# EasyEDA Pro project MSDRv2.eprj, board 4xAGCV1
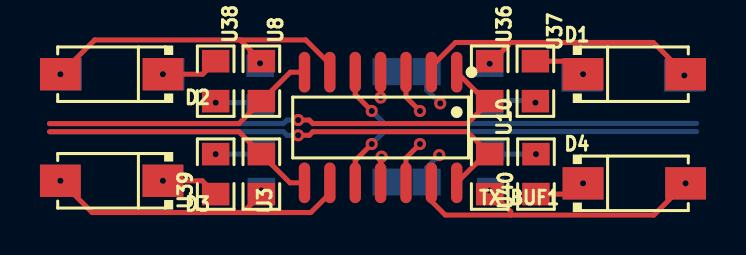
[diagram p11: board, top side]
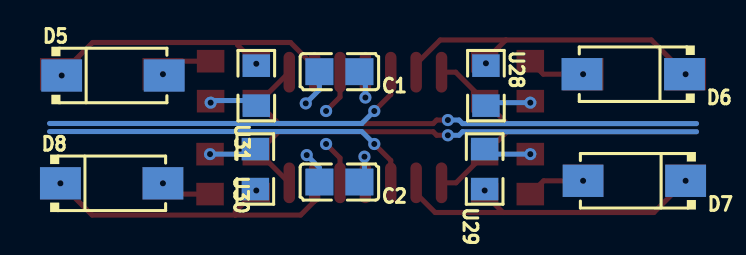
[diagram p12: board, bottom side, seen from below]

No outline. copper layers: Top Layer, Inner1, Inner2, Bottom Layer. Coordinates in mm from the lowest, leftmost part position.
Stack: Top Layer 0.035mm Outer layer thickness 1oz / Dielectric1 0.2104mm 7628 RC49% 8.6mil / Inner1 0.0152mm Inner layer thickness / Dielectric2 1.065mm 1.1mm H/HOZ Copper / Inner2 0.0152mm Inner layer thickness / Dielectric3 0.2104mm 7628 RC49% 8.6mil / Bottom Layer 0.035mm Outer layer thickness 1oz

## Design rules (mm)
net OUT2: DP2
net OUT3: DP1
net IN2: DP4
net IN3: DP3
net OUT1: DP2
net IN1: DP4
net IN4: DP3
net OUT4: DP1
template: JLCPCB Capability(Two Layers Board)
spacing copperThickness1oz (default): track to track 0.102, other pairs 0.152 to 0.3
spacing copperThickness2oz: track to track 0.203, other pairs 0.152 to 0.3
track width copperThickness1oz (default): min 0.127, default 0.254, max 2.54
track width copperThickness2oz: min 0.203, default 0.254, max 2.54
differential pair differentialPair (default): width min 0.127, default 0.254, max 2.54; gap min 0.152, default 0.152
via viaSize (default): diameter min 0.5, default 0.61, max 10; hole min 0.3, default 0.305, max 6.3

## Placement (name value [footprint] x y rotation side)
C1  100nF  [C0805]  14.76 5.59 0 bottom
C2  100nF  [C0805]  14.76 0.06 0 bottom
D1  -  [SMA_L4.4-W2.8-LS5.4-RD]  26.16 5.46 0 top
D2  -  [SMA_L4.4-W2.8-LS5.4-RD]  0 5.46 180 top
D3  -  [SMA_L4.4-W2.8-LS5.4-RD]  0 0.13 180 top
D4  -  [SMA_L4.4-W2.8-LS5.4-RD]  26.16 0 0 top
D5  -  [SMA_L4.4-W2.8-LS5.4-RD]  26.1 5.4 180 bottom
D6  -  [SMA_L4.4-W2.8-LS5.4-RD]  0.06 5.46 0 bottom
D7  -  [SMA_L4.4-W2.8-LS5.4-RD]  0 0.13 0 bottom
D8  -  [SMA_L4.4-W2.8-LS5.4-RD]  26.16 0 180 bottom
TX_BUF1  CLC4601ISO14X  [SOIC-14_L8.7-W3.9-P1.27-LS6.0-BL]  13.46 2.79 180 top
U3  1120  [R0805]  7.49 0.46 270 top
U8  1120  [R0805]  7.49 5.11 270 top
U10  1120  [R0805]  18.92 0.46 270 top
U28  1120  [R0805]  7.43 4.89 270 bottom
U29  1120  [R0805]  7.49 0.71 90 bottom
U30  1120  [R0805]  18.97 0.71 90 bottom
U31  1120  [R0805]  18.92 4.89 90 bottom
U36  1120  [R0805]  18.92 5.11 270 top
U37  1120  [R0805]  21.21 5.11 270 top
U38  1120  [R0805]  5.21 5.11 270 top
U39  1120  [R0805]  5.21 0.46 90 top
U40  1120  [R0805]  21.24 0.46 90 top

## Footprints (pads in the part's own frame, mm; a bottom-side part is the same pattern mirrored in y, then rotated)
C0805
  rect 1.41x1.35 smd: 1(-1,0) 2(1,0)
R0805
  rect 1.133x1.377 smd: 1(-1,0) 2(1,0)
SMA_L4.4-W2.8-LS5.4-RD
  rect 2.046x1.62 smd: 1(-2.566,0) 2(2.566,0)
SOIC-14_L8.7-W3.9-P1.27-LS6.0-BL
  oval 0.574x2.038 smd: 1(-3.81,-2.769) 2(-2.54,-2.769) 3(-1.27,-2.769) 4(0,-2.769) 5(1.27,-2.769) 6(2.54,-2.769) 7(3.81,-2.769) 8(3.81,2.769) 9(2.54,2.769) 10(1.27,2.769) 11(0,2.769) 12(-1.27,2.769) 13(-2.54,2.769) 14(-3.81,2.769)

## Nets
As in the schematic.

## Via types
v1: diameter 0.61, hole 0.305, Top Layer to Bottom Layer, 26 vias

## Routing (per net, layer and track width the routed paths; a pad name or vN(x,y) marks a point on that pad's centre or on a via; arc(x,y) is an arc through that point)
+5V: length 2.7
  Top Layer w0.254: TX_BUF1.4 v1(13.46,4.29)
  Bottom Layer w0.254: C1.1 13.46,5.29 v1(13.46,4.29)
-5V: length 2.7
  Top Layer w0.254: v1(13.51,1.33) 13.46,1.29 TX_BUF1.11
  Bottom Layer w0.254: C2.1 13.51,0.32 v1(13.51,1.33)
GND: length 12.6
  Bottom Layer w0.254: C1.2 15.76,4.68 v1(16.45,4) ; v1(21.21,4.04) 21.1,4.14 18.92,4.14 ; C2.2 15.76,0.78 v1(16.4,1.41) ; 18.97,1.46 v1(21.24,1.46) ; 7.49,1.46 v1(5.21,1.46) ; v1(5.21,4.04) 7.32,4.04 7.43,4.14
IN1: length 16.3
  Top Layer w0.254: v1(15.43,1.97) 14.73,1.27 TX_BUF1.12
  Inner1 w0.254: v1(15.43,1.97) 16.05,2.59 29.27,2.59
IN2: length 16.3
  Top Layer w0.254: TX_BUF1.3 14.73,4.32 v1(15.43,3.62)
  Inner1 w0.254: v1(15.43,3.62) 16.05,3 29.27,3
IN3: length 18.8
  Top Layer w0.254: v1(13.02,3.62) 12.19,4.44 TX_BUF1.5
  Bottom Layer w0.254: v1(13.02,3.62) 13.64,3 29.27,3
IN4: length 18.8
  Top Layer w0.254: v1(13.02,1.97) 12.19,1.14 TX_BUF1.10
  Bottom Layer w0.254: v1(13.02,1.97) 13.64,2.59 29.27,2.59
OUT1: length 24.9
  Top Layer w0.254: TX_BUF1.14 18.71,1.46 U10.1 17.8,2.58 10.07,2.58 9.89,2.41 v1(9.33,2.41)
  Bottom Layer w0.254: -3.11,2.58 8.6,2.58 8.78,2.41 v1(9.33,2.41)
OUT2: length 24.9
  Top Layer w0.254: TX_BUF1.1 18.72,4.11 U36.2 17.8,2.99 10.07,2.99 9.89,3.17 v1(9.33,3.17)
  Bottom Layer w0.254: -3.11,2.99 8.6,2.99 8.78,3.17 v1(9.33,3.17)
OUT3: length 13.8
  Top Layer w0.254: -3.11,2.99 6.37,2.99 U8.2 8.94,5.56 TX_BUF1.7
OUT4: length 13.8
  Top Layer w0.254: TX_BUF1.8 8.93,0.02 U3.1 6.37,2.58 -3.11,2.58
$1N983: length 2.7
  Top Layer w0.254: v1(23.6,5.46) 22.95,6.11 U37.1
$1N984: length 15.6
  Top Layer w0.254: 19.86,7.05 19.86,6.92 v1(18.92,5.98) ; 19.86,7.05 27.11,7.05 28.7,5.46 D1.2 ; 19.86,7.05 17.21,7.05 16,5.84 TX_BUF1.2
  vias: v1(28.66,5.4)
$1N985: length 16.6
  Top Layer w0.254: 6.43,7.18 -0.85,7.18 v1(-2.57,5.46) ; 6.43,7.18 9.72,7.18 10.92,5.97 TX_BUF1.6 ; 6.43,7.18 U8.1
  vias: v1(7.43,6.01)
$1N986: length 2.9
  Top Layer w0.254: v1(2.57,5.46) 4.56,5.46 U38.1
$1N987: length 2.9
  Top Layer w0.254: v1(2.57,0.13) 4.54,0.13 U39.1
$1N988: length 16.4
  Top Layer w0.254: TX_BUF1.9 10.92,-0.51 9.97,-1.46 6.57,-1.46 ; 6.57,-1.46 -0.98,-1.46 v1(-2.57,0.13) ; 6.57,-1.46 U3.2
  vias: v1(7.49,-0.36)
$1N989: length 16.2
  Top Layer w0.254: 19.97,-1.59 19.97,-1.41 v1(18.92,-0.36) ; 19.97,-1.59 16.7,-1.59 16,-0.89 TX_BUF1.13 ; 19.97,-1.59 27.14,-1.59 v1(28.73,0)
$1N990: length 2.6
  Top Layer w0.254: U40.1 23.06,-0.54 v1(23.6,0)
